# Altium schematic sheet Relays.SchDoc: LCL_GDI (DELUX)
size A4; Address1: ludzinc.blogspot.com.au; Address3: www.lowcostlabs.com.au; DocumentNumber: LCL_004; Revision: V2.00; SheetNumber: 5; SheetTotal: 8
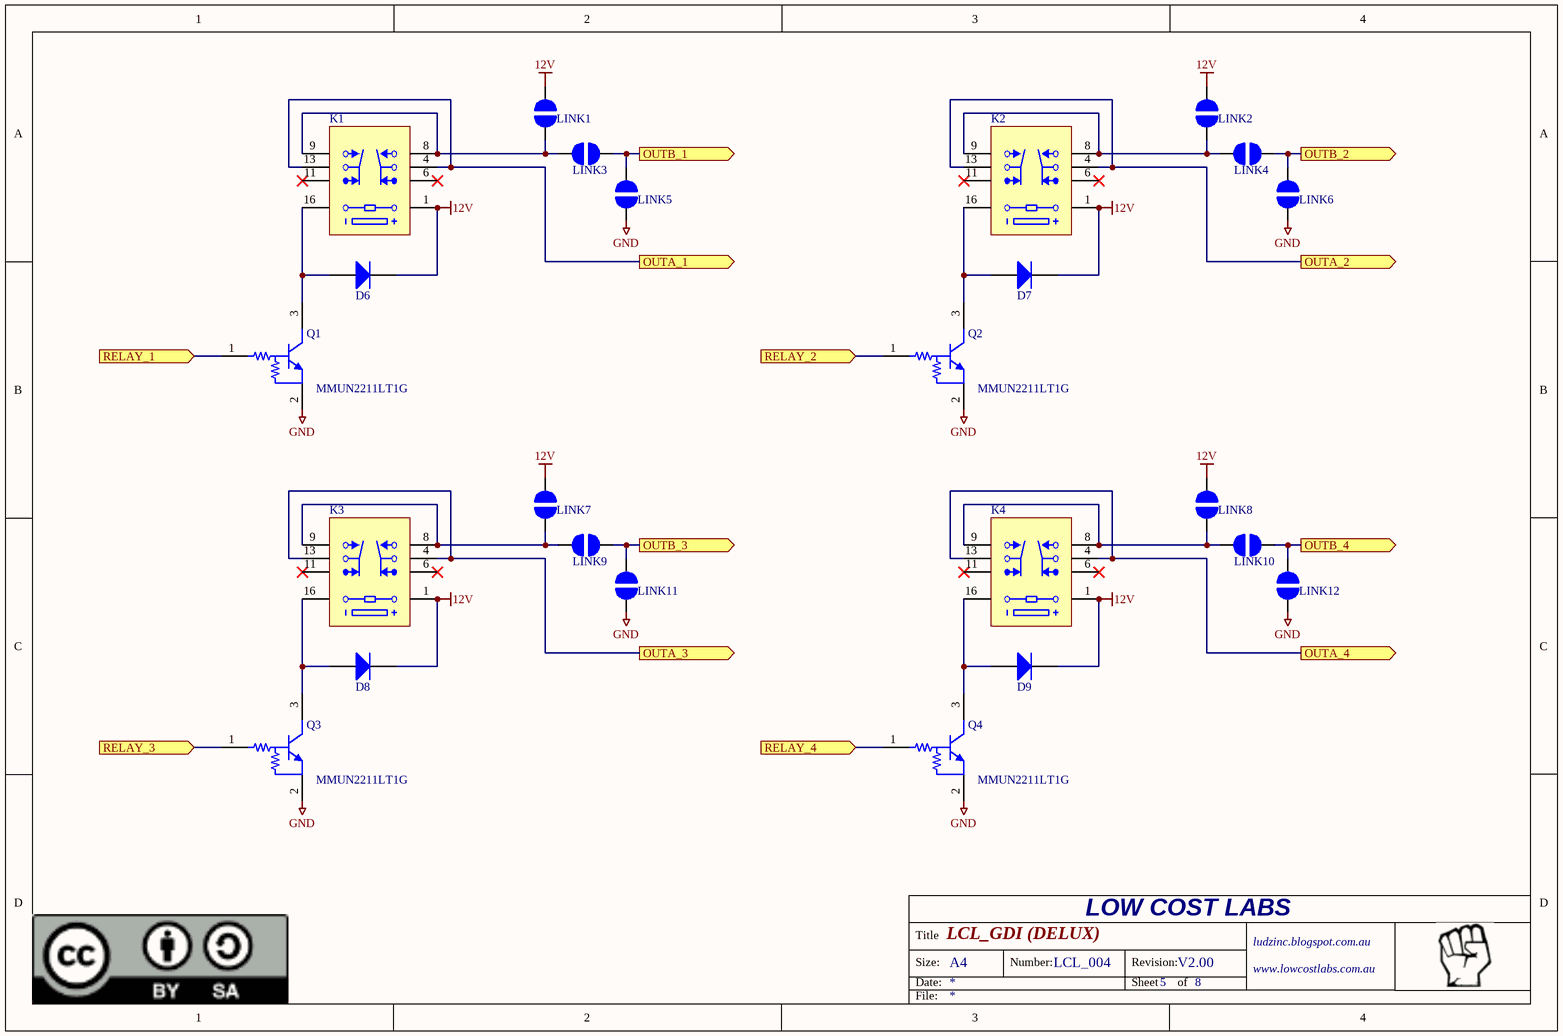
[diagram p0: Relays.SchDoc]

## Parts
D6  Vishay / Semiconductors S1MHE3/61T  [ONSC-SMA-2-403D-02_V]  (value not drawn)
D7  Vishay / Semiconductors S1MHE3/61T  [ONSC-SMA-2-403D-02_V]  (value not drawn)
D8  Vishay / Semiconductors S1MHE3/61T  [ONSC-SMA-2-403D-02_V]  (value not drawn)
D9  Vishay / Semiconductors S1MHE3/61T  [ONSC-SMA-2-403D-02_V]  (value not drawn)
K1  Panasonic DS2Y-S-DC12V  [PCB-d08qloczi00j7cf9smyl-1]  (value not drawn)
K2  Panasonic DS2Y-S-DC12V  [PCB-d08qloczi00j7cf9smyl-1]  (value not drawn)
K3  Panasonic DS2Y-S-DC12V  [PCB-d08qloczi00j7cf9smyl-1]  (value not drawn)
K4  Panasonic DS2Y-S-DC12V  [PCB-d08qloczi00j7cf9smyl-1]  (value not drawn)
LINK1  SOLDER JUMPER  [PCB-btzmmfon80v3o3bq8yuz-1]  (value not drawn)  (no BOM)
LINK2  SOLDER JUMPER  [PCB-btzmmfon80v3o3bq8yuz-1]  (value not drawn)  (no BOM)
LINK3  SOLDER JUMPER  [PCB-btzmmfon80v3o3bq8yuz-1]  (value not drawn)  (no BOM)
LINK4  SOLDER JUMPER  [PCB-btzmmfon80v3o3bq8yuz-1]  (value not drawn)  (no BOM)
LINK5  SOLDER JUMPER  [PCB-btzmmfon80v3o3bq8yuz-1]  (value not drawn)  (no BOM)
LINK6  SOLDER JUMPER  [PCB-btzmmfon80v3o3bq8yuz-1]  (value not drawn)  (no BOM)
LINK7  SOLDER JUMPER  [PCB-btzmmfon80v3o3bq8yuz-1]  (value not drawn)  (no BOM)
LINK8  SOLDER JUMPER  [PCB-btzmmfon80v3o3bq8yuz-1]  (value not drawn)  (no BOM)
LINK9  SOLDER JUMPER  [PCB-btzmmfon80v3o3bq8yuz-1]  (value not drawn)  (no BOM)
LINK10  SOLDER JUMPER  [PCB-btzmmfon80v3o3bq8yuz-1]  (value not drawn)  (no BOM)
LINK11  SOLDER JUMPER  [PCB-btzmmfon80v3o3bq8yuz-1]  (value not drawn)  (no BOM)
LINK12  SOLDER JUMPER  [PCB-btzmmfon80v3o3bq8yuz-1]  (value not drawn)  (no BOM)
Q1  MMUN2211LT1G  [ONSC-SOT-23-3-318-08_V]
Q2  MMUN2211LT1G  [ONSC-SOT-23-3-318-08_V]
Q3  MMUN2211LT1G  [ONSC-SOT-23-3-318-08_V]
Q4  MMUN2211LT1G  [ONSC-SOT-23-3-318-08_V]

## Ports
OUTA_1 (out), OUTA_2 (out), OUTA_3 (out), OUTA_4 (out), OUTB_1 (out), OUTB_2 (out), OUTB_3 (out), OUTB_4 (out), RELAY_1 (in), RELAY_2 (in), RELAY_3 (in), RELAY_4 (in)

## Nets
12V: D6.2(K) D7.2(K) D8.2(K) D9.2(K) K1.1 K2.1 K3.1 K4.1 LINK1.1 LINK2.1 LINK7.1 LINK8.1
GND: LINK5.2 LINK6.2 LINK11.2 LINK12.2 Q1.2(E) Q2.2(E) Q3.2(E) Q4.2(E)
OUTA_1: K1.4 K1.13 ; port OUTA_1
OUTA_2: K2.4 K2.13 ; port OUTA_2
OUTA_3: K3.4 K3.13 ; port OUTA_3
OUTA_4: K4.4 K4.13 ; port OUTA_4
OUTB_1: LINK3.2 LINK5.1 ; port OUTB_1
OUTB_2: LINK4.2 LINK6.1 ; port OUTB_2
OUTB_3: LINK9.2 LINK11.1 ; port OUTB_3
OUTB_4: LINK10.2 LINK12.1 ; port OUTB_4
RELAY_1: Q1.1(B) ; port RELAY_1
RELAY_2: Q2.1(B) ; port RELAY_2
RELAY_3: Q3.1(B) ; port RELAY_3
RELAY_4: Q4.1(B) ; port RELAY_4
NetD6_1: D6.1(A) K1.16 Q1.3(C)
NetD7_1: D7.1(A) K2.16 Q2.3(C)
NetD8_1: D8.1(A) K3.16 Q3.3(C)
NetD9_1: D9.1(A) K4.16 Q4.3(C)
NetK1_8: K1.8 K1.9 LINK1.2 LINK3.1
NetK2_8: K2.8 K2.9 LINK2.2 LINK4.1
NetK3_8: K3.8 K3.9 LINK7.2 LINK9.1
NetK4_8: K4.8 K4.9 LINK8.2 LINK10.1

Not connected (* = marked no-connect by the designer): K1 6* 11*; K2 6* 11*; K3 6* 11*; K4 6* 11*

## Notes on the sheet
- LOW COST LABS
- Title
- Size:
- Date:
- A4
- Number:
- Revision:
- Sheet
- of
- File:

## Library data of the parts
D6-D9 = Vishay / Semiconductors S1MHE3/61T-4: DIODE GPP 1A 1000V SMA DO-214AC; Max Surge Current: 30 A; Recovery Time: 1800 ns; CiivaID: 3109060; Reverse Current IR: 5 uA; Configuration: Single; Forward Voltage Drop: 1.1 V; Packaging: Reel; Forward Continuous Current: 1 A; Manufacturer Part Number: S1MHE3/61T; Minimum Operating Temperature: - 55 C; Ciiva URL: https://ciiva.com/part/s1mhe3-61t-3109060; RoHS: Details; Manufacturer: Vishay; Mounting Style: SMD/SMT; Reverse Voltage: 1000 V; Product: Standard Recovery Rectifiers; Package / Case: SMA; Maximum Operating Temperature: + 150 C; Factory Pack Quantity: 1800; Product Category: Rectifiers
K1-K4 = CMP-a9a660dd73707661-2: Relay; E-Mech; non-Latching; DPDT-NO/NC; Cur-Rtg 2A; Ctrl-V 12DC; Vol-Rtg 250/220AC/DC; Power Rating: 60.0 W; Lead-Free Status: Lead Free; Carry Current: 3.0 A; Rise Time: 0.004 s; Coil Resistance: 720.0 Ω; Contact Current Rating: 2.0 A; Coil Power (DC): 0.2 W; Coil Current: 0.0167 A; Contacts Type: DPDT; Coil Voltage: 12.0 V; Lifecycle Status: Active; Size-Length: 0.0199898 m; Octopart URL: http://octopart.com/ds2y-s-dc12v-panasonic-7471024; RoHS: Compliant; Mounting Style: PCB; Manufacturer Part Number: DS2Y-S-DC12V; Size-Height: 0.0092964 m; OctopartID: a9a660dd73707661; Size-Width: 0.009906 m; Packaging: Tray; Contact Material: Silver
LINK1-LINK12 = CMP-awopsk420h7r935fi2ee-3: CustomComponentID: awopsk420h7r935fi2ee
Q1-Q4 = CMP-866803-1: Digital Transistor (BRT), R1=10 kOhm, R2=10 kOhm, NPN Transistor, 3-Pin SOT-23, Pb-Free, Tape and Reel; SVHC: No SVHC (19-Dec-2012); Transistor Type: Bias Resistor (BRT); Power Dissipation Pd: 246mW; Collector Emitter Voltage Vces: -250mV; Pin Configuration: 1; Voltage Vcbo: 50V; No. of Pins: 3; Current Ic hFE: 5mA; DC Collector Current: 100mA; DC Current Gain hFE: 60; SMD Marking: A8A; Power Dissipation Ptot Max: 200mW; CiivaID: 866803; Hfe Min: 35; Resistance R1: 10kohm; Transistor Case Style: SOT-23; Transistor Polarity: NPN; Collector Emitter Voltage V(br)ceo: 50V; Ciiva URL: https://ciiva.com/part/MMUN2211LT1G-866803; Package / Case: SOT-23; No. of Transistors: 1; Resistance R2: 10kohm